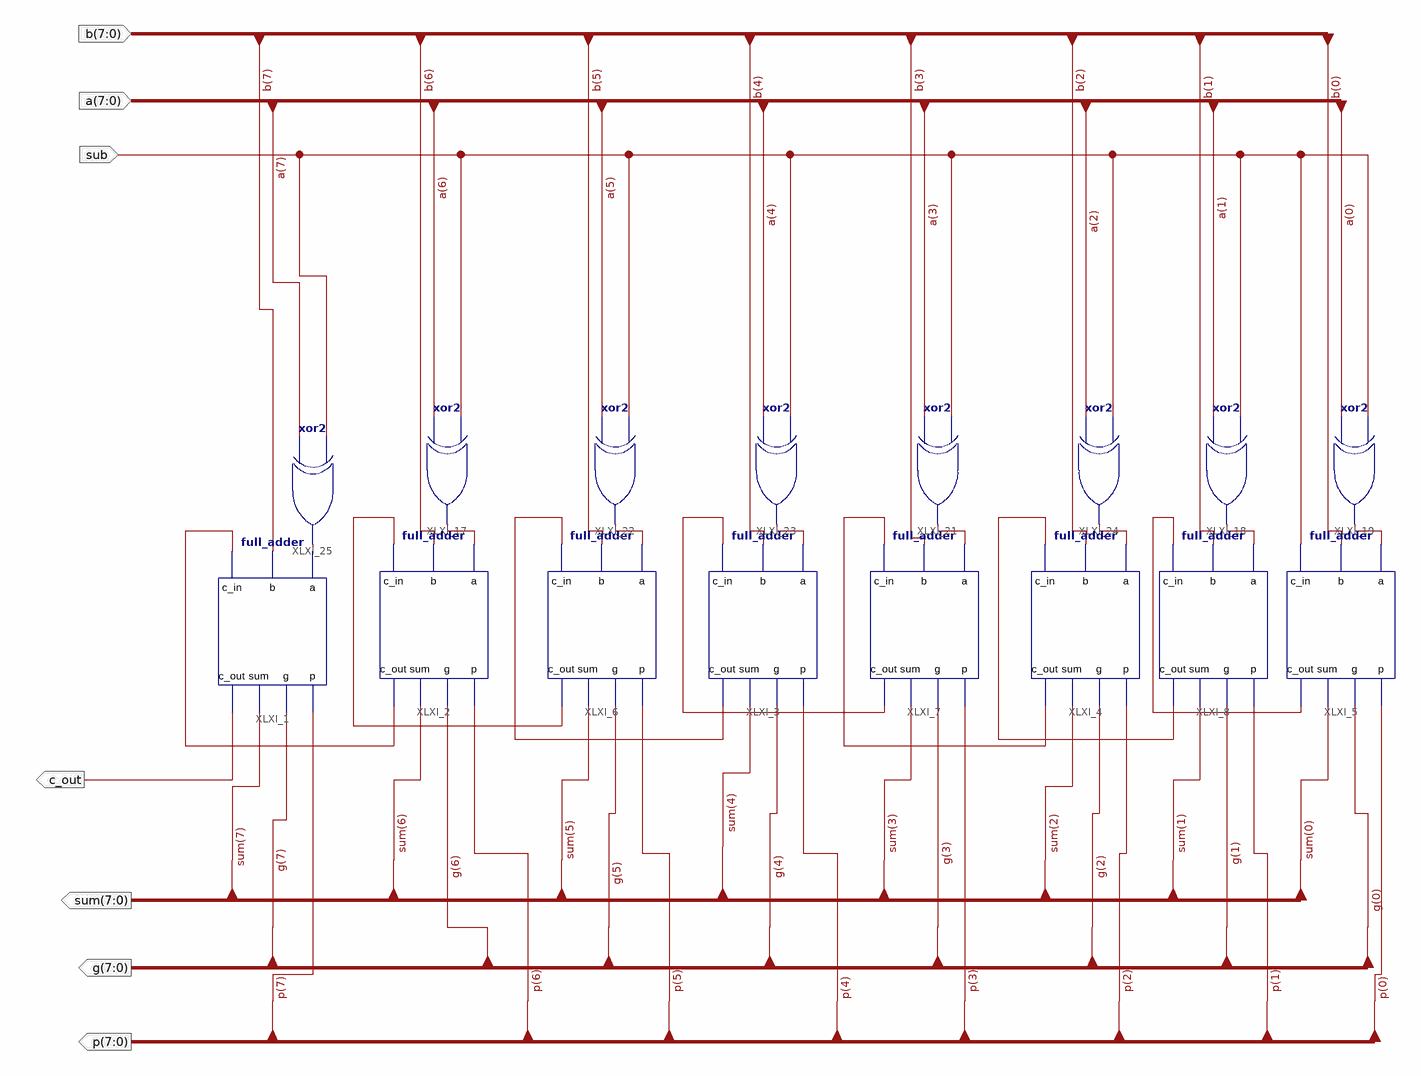
[diagram p0: schematic sheet 1]
// Xilinx ISE schematic full_adder_8bit.sch (spartan3e) as structural Verilog: 16 symbols, 7 ports
module full_adder_8bit (
  input  [7:0] b,
  input  [7:0] a,
  input  sub,
  output [7:0] sum,
  output c_out,
  output [7:0] g,
  output [7:0] p
);

  wire XLXN_1, XLXN_102, XLXN_104, XLXN_112, XLXN_121, XLXN_122, XLXN_123, XLXN_124, XLXN_125, XLXN_126,
       XLXN_127, XLXN_128, XLXN_129, XLXN_133, XLXN_134;

  full_adder XLXI_1 (.a(XLXN_112), .b(b[7]), .c_in(XLXN_1), .p(p[7]), .g(g[7]), .sum(sum[7]), .c_out(c_out));
  full_adder XLXI_6 (.a(XLXN_134), .b(b[5]), .c_in(XLXN_122), .p(p[5]), .g(g[5]), .sum(sum[5]), .c_out(XLXN_121));
  full_adder XLXI_7 (.a(XLXN_128), .b(b[3]), .c_in(XLXN_104), .p(p[3]), .g(g[3]), .sum(sum[3]), .c_out(XLXN_123));
  xor XLXI_21 (XLXN_128, a[3], sub);
  xor XLXI_22 (XLXN_134, a[5], sub);
  xor XLXI_24 (XLXN_125, a[2], sub);
  full_adder XLXI_5 (.a(XLXN_127), .b(b[0]), .c_in(sub), .p(p[0]), .g(g[0]), .sum(sum[0]), .c_out(XLXN_102));
  xor XLXI_19 (XLXN_127, a[0], sub);
  xor XLXI_18 (XLXN_126, a[1], sub);
  xor XLXI_17 (XLXN_133, a[6], sub);
  full_adder XLXI_2 (.a(XLXN_133), .b(b[6]), .c_in(XLXN_121), .p(p[6]), .g(g[6]), .sum(sum[6]), .c_out(XLXN_1));
  full_adder XLXI_3 (.a(XLXN_129), .b(b[4]), .c_in(XLXN_123), .p(p[4]), .g(g[4]), .sum(sum[4]), .c_out(XLXN_122));
  xor XLXI_23 (XLXN_129, a[4], sub);
  full_adder XLXI_4 (.a(XLXN_125), .b(b[2]), .c_in(XLXN_124), .p(p[2]), .g(g[2]), .sum(sum[2]), .c_out(XLXN_104));
  full_adder XLXI_8 (.a(XLXN_126), .b(b[1]), .c_in(XLXN_102), .p(p[1]), .g(g[1]), .sum(sum[1]), .c_out(XLXN_124));
  xor XLXI_25 (XLXN_112, a[7], sub);
endmodule
